# Altium schematic sheet Power.SchDoc
size A4
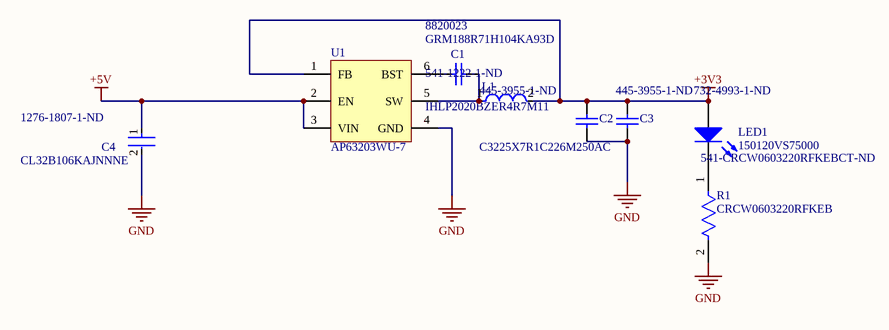
[diagram p0: Power.SchDoc]

## Parts
C1  GRM188R71H104KA93D  Supplier Part Number 1: 8820023  [CAPC1608X90X35ML10T15]
C2  C3225X7R1C226M250AC  Supplier Part Number 1: 445-3955-1-ND  [CAPC3225X280X20LL40]
C3  Supplier Part Number 1: 445-3955-1-ND  [CAPC3225X280X20LL40]  (hidden comment: C3225X7R1C226M250AC)
C4  CL32B106KAJNNNE  Supplier Part Number 1: 1276-1807-1-ND  [FP-CL32-IPC_C]
L1  IHLP2020BZER4R7M11  Supplier Part Number 1: 541-1222-1-ND  [FP-IHLP-2020BZ-FP_1_905x2-MFG]
LED1  150120VS75000  Supplier Part Number 1: 732-4993-1-ND  [1206_A]
R1  CRCW0603220RFKEB  Supplier Part Number 1: 541-CRCW0603220RFKEBCT-ND  [FP-CRCW0603-e3-MFG]
U1  Manufacturer Part Number 1: AP63203WU-7  [TSOT26]  (hidden comment: 3.3V SW Reg (AP63203WU-7))

## Nets
+3V3: C2.2 C3.2 L1.2 LED1.2(A) U1.1(FB)
+5V: C4.1 U1.2(EN) U1.3(VIN)
GND: C2.1 C3.1 C4.2 R1.2 U1.4(GND)
NetC1_1: C1.1 L1.1 U1.5(SW)
NetC1_2: C1.2 U1.6(BST)
NetLED1_1: LED1.1(K) R1.1

## Library data of the parts
C1 = CMP-2100-03643-1: Chip Capacitor, 0.1 uF, +/- 10%, 50 V, -55 to 125 degC, 0603 (1608 Metric), RoHS, Tape and Reel; Manufacturer: Murata; Dielectric Material: Ceramic; Voltage Rating: 50V; Capacitance: 100nF; Dielectric: X7R; Insulation Resistance: 10GR; Description: CERAMIC CAPACITOR, 0.1UF, 50V, X7R, 10%, 0603, FULL REEL; Product Range:GRM Series; Capacitance:0.1 F; Capacitance Tolerance:  10%; Dielectric Characteristic:X7R; Voltage Rating:50V; Ceramic Capacitor Case:0603 ^1608 Metric]; MSL:-; Case Code (Metric): 1608; Lead Free: LeadFree; Depth: 0.8mm; Number of Pins: 2; Radiation Hardening: No; Case/Package: 0603; Manufacturer URL: http://www.murata.com/; Packaging: TapeandReel; Length: 1.6mm; Contact Plating: Tin; Datasheet URL: http://psearch.en.murata.com/capacitor/product/GRM188R71H104KA93%23.pdf; Tolerance: 10%; Case Code (Imperial): 0603; Min Operating Temperature: -55degC; RoHSCompliant: true; Voltage: 50V; Termination: SMD/SMT; Mount: SurfaceMount; Material: Ceramic; Package Quantity: 1; Height: 0.8mm; Thickness: 0.035inch; REACH SVHC: NoSVHC; Max Operating Temperature: 125degC; Width: 0.8mm; Package Reference: 0603; Voltage Rating (DC): 50V; Datasheet Version: 42675.0; Package Description: 2-Pin Surface Mount Device, Body 1.6 x 0.8 mm; Supplier 1: Farnell; Manufacturer Part Number: GRM188R71H104KA93D; RoHS: Yes; Category: Ceramic Capacitors; ComponentLink1URL: https://datasheet.ciiva.com/11786/0900766b807a1cab-11786047.pdf?src-supplier=RSComponents; ComponentLink1Description: https://datasheet.ciiva.com/11786/0900766b807a1cab-11786047.pdf?src-supplier=RSComponents; ComponentLink2URL: https://datasheet.ciiva.com/19467/1857604-19467681.pdf?src-supplier=Jameco; ComponentLink2Description: https://datasheet.ciiva.com/19467/1857604-19467681.pdf?src-supplier=Jameco; ComponentLink3URL: https://datasheet.ciiva.com/29201/451744-da-01-en-vs-kondensator-0603-29201904.pdf?src-supplier=Conrad; ComponentLink3Description: https://datasheet.ciiva.com/29201/451744-da-01-en-vs-kondensator-0603-29201904.pdf?src-supplier=Conrad; ComponentLink4URL: https://datasheet.ciiva.com/28534/4360-28534245.pdf?src-supplier=Element14; ComponentLink4Description: https://datasheet.ciiva.com/28534/4360-28534245.pdf?src-supplier=Element14; ComponentLink5URL: https://datasheet.ciiva.com/131/partnumbering-e-01-131738.pdf?src-supplier=Digi-Key; ComponentLink5Description: https://datasheet.ciiva.com/131/partnumbering-e-01-131738.pdf?src-supplier=Digi-Key; ComponentLink6URL: https://datasheet.ciiva.com/131/partnumbering-e-01-131739.pdf?src-supplier=Digi-Key; ComponentLink6Description: https://datasheet.ciiva.com/131/partnumbering-e-01-131739.pdf?src-supplier=Digi-Key; ComponentLink7URL: https://datasheet.ciiva.com/7937/4360-7937659.pdf?src-supplier=Element14; ComponentLink7Description: https://datasheet.ciiva.com/7937/4360-7937659.pdf?src-supplier=Element14; ComponentLink8URL: https://datasheet.ciiva.com/7937/1747470-7937658.pdf?src-supplier=Element14; ComponentLink8Description: https://datasheet.ciiva.com/7937/1747470-7937658.pdf?src-supplier=Element14; ComponentLink9URL: https://datasheet.ciiva.com/48436/nmgrm-data-en-48436667.pdf?src-supplier=Distrelec; ComponentLink9Description: https://datasheet.ciiva.com/48436/nmgrm-data-en-48436667.pdf?src-supplier=Distrelec; ComponentLink10URL: https://datasheet.ciiva.com/131/partnumbering-e-01-131740.pdf?src-supplier=Digi-Key; ComponentLink10Description: https://datasheet.ciiva.com/131/partnumbering-e-01-131740.pdf?src-supplier=Digi-Key; ComponentLink11URL: https://datasheet.ciiva.com/14116/nmgrm-data-en-14116602.pdf?src-supplier=Distrelec; ComponentLink11Description: https://datasheet.ciiva.com/14116/nmgrm-data-en-14116602.pdf?src-supplier=Distrelec
C2 C3 = CMP-2000-06052-1: Multilayer Ceramic Capacitor, 22 uF, 16 V, -55 to 125 degC, 2-Pin SMD, RoHS, Tape and Reel; PCN Part Number: MLCCPartNumberChange30/Nov/2012; Manufacturer: TDK; Tolerance: ±20%; Online Catalog: CSeries,GeneralPurpose; Catalog Drawings: CSERIES_1210_2.8; Capacitance: 22µF; Voltage - Rated: 16V; Temperature Coefficient: X7R; Other Names: 445-3955-6; Product Training Modules: HighCapacitanceReplacementCSeriesGeneralApplicationsSEAT,CCV,andTVCLDesignToolsGuidetoReplacinganElectrolyticCapacitorwithanMLCC; Description: TDK - C3225X7R1C226M250AC - SMD Multilayer Ceramic Capacitor, 22 &#181;F, 16 V, 1210 [3225 Metric], &#177; 20%, X7R, C Series; Lead Style: -; Thickness (Max): 0.110"(2.80mm); Lead Spacing: -; Package Reference: 1210; Package / Case: 1210(3225Metric); Operating Temperature: -55°C~125°C; Standard Package: 1; Features: -; Datasheet URL: https://datasheet.ciiva.com/24216/c3225x7r1c226m250ac-265468-24216381.pdf; Manufacturer URL: http://www.tdk.com/; Datasheet Version: 09/2013; Mounting Technology: SurfaceMount; Family: CeramicCapacitors; Height - Seated (Max): -; Mounting Type: SurfaceMount,MLCC; Series: C; Size / Dimension: 0.126"Lx0.098"W(3.20mmx2.50mm); Packaging: Digi-Reel®; Ratings: -; Package Description: 2-Pin Surface Mount Device, Body 3.2 x 2.5 mm; Applications: GeneralPurpose; RoHS Information: RoHSCertificate-MLCC; Category: Capacitors; Supplier 1: Digi-Key; Manufacturer Part Number: C3225X7R1C226M250AC; RoHS: Yes; Stock 1: 684134; Mount: Surface Mount; Case/Package: 1210; Number of Pins: 2; Weight: 0.000564oz; Case Code (Metric): 3225; Case Code (Imperial): 1210; Dielectric Material: Ceramic; Min Operating Temperature: -55°C; Max Operating Temperature: 125°C; Dielectric: X7R; Package Quantity: 1; Voltage Rating: 16V; Voltage Rating (DC): 16V; Termination: SMD/SMT; Resistor Type: Ceramic; Length: 3.2mm; Height: 2.5mm; Depth: 2.5mm; Width: 0.098inch; Thickness: 0.11inch; Radiation Hardening: No; REACH SVHC: No SVHC; Lead Free: Lead Free; ComponentLink1URL: https://datasheet.ciiva.com/24216/c3225x7r1c226m250ac-265468-24216381.pdf?src-supplier=Mouser; ComponentLink1Description: https://datasheet.ciiva.com/24216/c3225x7r1c226m250ac-265468-24216381.pdf?src-supplier=Mouser; ComponentLink2URL: https://datasheet.ciiva.com/6252/tdkmlcccaprange-6252933.pdf?src-supplier=Digi-Key; ComponentLink2Description: https://datasheet.ciiva.com/6252/tdkmlcccaprange-6252933.pdf?src-supplier=Digi-Key; ComponentLink3URL: https://datasheet.ciiva.com/7975/639999-7975159.pdf?src-supplier=Element14; ComponentLink3Description: https://datasheet.ciiva.com/7975/639999-7975159.pdf?src-supplier=Element14; ComponentLink4URL: https://datasheet.ciiva.com/6145/1571323-6145128.pdf?src-supplier=Farnell; ComponentLink4Description: https://datasheet.ciiva.com/6145/1571323-6145128.pdf?src-supplier=Farnell; ComponentLink5URL: https://datasheet.ciiva.com/28620/1571323-28620648.pdf?src-supplier=Element14; ComponentLink5Description: https://datasheet.ciiva.com/28620/1571323-28620648.pdf?src-supplier=Element14; ComponentLink6URL: https://datasheet.ciiva.com/6252/tdkmlcccaprange-6252937.pdf?src-supplier=Digi-Key; ComponentLink6Description: https://datasheet.ciiva.com/6252/tdkmlcccaprange-6252937.pdf?src-supplier=Digi-Key; ComponentLink7URL: https://datasheet.ciiva.com/17487/e412-c-17487337.pdf?src-supplier=Avnet+Europe; ComponentLink7Description: https://datasheet.ciiva.com/17487/e412-c-17487337.pdf?src-supplier=Avnet+Europe; ComponentLink8URL: https://datasheet.ciiva.com/15192/getdatasheetpartid-715071-15192314.pdf?src-supplier=Verical; ComponentLink8Description: https://datasheet.ciiva.com/15192/getdatasheetpartid-715071-15192314.pdf?src-supplier=Verical; ComponentLink9URL: https://datasheet.ciiva.com/6252/tdkmlcccaprange-6252940.pdf?src-supplier=Digi-Key; ComponentLink9Description: https://datasheet.ciiva.com/6252/tdkmlcccaprange-6252940.pdf?src-supplier=Digi-Key; ComponentLink10URL: https://datasheet.ciiva.com/7878/1571323-7878125.pdf?src-supplier=Element14; ComponentLink10Description: https://datasheet.ciiva.com/7878/1571323-7878125.pdf?src-supplier=Element14; ComponentLink11URL: https://datasheet.ciiva.com/16199/e412-c-16199357.pdf?src-supplier=Future+Electronics; ComponentLink11Description: https://datasheet.ciiva.com/16199/e412-c-16199357.pdf?src-supplier=Future+Electronics
C4 = CMP-13271-001383-1: Cap Ceramic 10uF 25V X7R ±10% SMD 1210 +125°C Embossed T/R; Manufacturer: Samsung; Description: Cap Ceramic 10uF 25V X7R 10% SMD 1210 125C Embossed T/R; Capacitance: 10uF; Width: 0.098inch; Min Operating Temperature: -55°C; Case Code (Metric): 3225; Case Code (Imperial): 1210; Material: Ceramic; Height: 2.5mm; Depth: 2.5mm; Contact Plating: Tin; Max Operating Temperature: 125°C; Length: 3.2mm; Mount: Surface Mount; Packaging: Tape and Reel; Dielectric: X7R; Tolerance: 10%; Radiation Hardening: No; Thickness: 0.106inch; Package Quantity: 1000; Voltage Rating: 25V; Voltage: 25V; Case/Package: 1210; Supplier 1: Digi-Key; Manufacturer Part Number: CL32B106KAJNNNE; RoHS: Yes; Category: Ceramic Capacitors; Stock 1: 108118; ComponentLink1URL: https://datasheet.ciiva.com/25791/cl32b106kajnnne-25791845.pdf?src-supplier=Digi-Key; ComponentLink1Description: https://datasheet.ciiva.com/25791/cl32b106kajnnne-25791845.pdf?src-supplier=Digi-Key; ComponentLink2URL: https://datasheet.ciiva.com/16437/cl32b106kajnnne-16437180.pdf?src-supplier=Future+Electronics; ComponentLink2Description: https://datasheet.ciiva.com/16437/cl32b106kajnnne-16437180.pdf?src-supplier=Future+Electronics; ComponentLink3URL: https://datasheet.ciiva.com/29202/450857-da-01-en-vs-kondensator-1210-29202679.pdf?src-supplier=Conrad; ComponentLink3Description: https://datasheet.ciiva.com/29202/450857-da-01-en-vs-kondensator-1210-29202679.pdf?src-supplier=Conrad
L1 = CMP-02424-000416-1: Fixed Inductors Commercial Low DCR Series 4.7uH 3.2A 81.3mΩ 20%; Manufacturer: Vishay Dale; Saturation Current: 3A; Shielding: Shielded; Core Material: Metal; Self Resonant Frequency: 27MHz; Test Frequency: 100kHz; DC Resistance (DCR): 81.3mR; Description: FIXED IND 4.7UH 3.2A 81.3 MOHM; Height - Seated (Max): 0.079inch; Mount: Surface Mount; Max Operating Temperature: 125°C; Termination: SMD/SMT; Depth: 5.43mm; Lead Free: Lead Free; Inductance Tolerance: 20%; Height: 2mm; Length: 5.49mm; Package Quantity: 2000; Tolerance: 20%; Min Operating Temperature: -55°C; Case/Package: 2020; Radiation Hardening: No; Number of Pins: 2020; Military Standard: Not; Inductance: 4.7uH; Packaging: Tape and Reel; Width: 0.204inch; Current Rating: 3.2A; RMS Current (Irms): 3.2A; Max DC Current: 3A; Supplier 1: Digi-Key; Manufacturer Part Number: IHLP2020BZER4R7M11; RoHS: Yes; Category: Fixed Inductors; Stock 1: 301; REACH SVHC: Unknown; ComponentLink1URL: https://datasheet.ciiva.com/11798/0900766b8102c92e-11798345.pdf?src-supplier=RSComponents; ComponentLink1Description: https://datasheet.ciiva.com/11798/0900766b8102c92e-11798345.pdf?src-supplier=RSComponents; ComponentLink2URL: https://datasheet.ciiva.com/16496/lp20bz11-16496630.pdf?src-supplier=Future+Electronics; ComponentLink2Description: https://datasheet.ciiva.com/16496/lp20bz11-16496630.pdf?src-supplier=Future+Electronics; ComponentLink3URL: https://datasheet.ciiva.com/1051/lp20bz11-1051771.pdf?src-supplier=Digi-Key; ComponentLink3Description: https://datasheet.ciiva.com/1051/lp20bz11-1051771.pdf?src-supplier=Digi-Key; ComponentLink4URL: https://datasheet.ciiva.com/1051/lp20bz11-1051772.pdf?src-supplier=Digi-Key; ComponentLink4Description: https://datasheet.ciiva.com/1051/lp20bz11-1051772.pdf?src-supplier=Digi-Key; ComponentLink5URL: https://datasheet.ciiva.com/1051/lp20bz11-1051773.pdf?src-supplier=Digi-Key; ComponentLink5Description: https://datasheet.ciiva.com/1051/lp20bz11-1051773.pdf?src-supplier=Digi-Key
LED1 = CMP-1426-00016-1: SMD mono-color Chip LED, WL-SMCW, Bright Green; Manufacturer: Wuerth Elektronik; Description: LED, Green, 570 nm, 2 V, 30 mA, 40 mcd; Luminous Intensity: 40mcd; Forward Current: 30mA; Forward Voltage: 2V; Viewing Angle: 140°; Lens Style: Clear,Rectangular; Wavelength: 570nm; Test Current: 20mA; ComponentLink2URL: http://katalog.we-online.com/led/datasheet/150120VS75000.pdf; PartNumber: 150120VS75000; Color: Bright Green; ComponentLink2Description: Datasheet; ComponentLink1URL: http://www.we-online.com; PackageReference: 1206_A; ComponentLink1Description: Manufacturer URL; Supplier 1: Digi-Key; Manufacturer Part Number: 150120VS75000; RoHS: Yes; Category: LEDs; Stock 1: 4286; Mount: Surface Mount; Case/Package: 1206; Case Code (Metric): 3216; Case Code (Imperial): 1206; Min Operating Temperature: -40°C; Max Operating Temperature: 85°C; Package Quantity: 1; Packaging: Tape and Reel; Dominant Wavelength: 570nm; Length: 3.2mm; Height: 0.68mm; Width: 1.6mm; REACH SVHC: Unknown; ComponentLink3URL: https://datasheet.ciiva.com/29561/150120vs75000-29561865.pdf?src-supplier=Digi-Key; ComponentLink3Description: https://datasheet.ciiva.com/29561/150120vs75000-29561865.pdf?src-supplier=Digi-Key; ComponentLink4URL: https://datasheet.ciiva.com/29279/759444-da-01-en-chipled-1206-w-kl-h-gruen-150120vs7500-29279050.pdf?src-supplier=Conrad; ComponentLink4Description: https://datasheet.ciiva.com/29279/759444-da-01-en-chipled-1206-w-kl-h-gruen-150120vs7500-29279050.pdf?src-supplier=Conrad; ComponentLink5URL: https://datasheet.ciiva.com/29561/150120vs75000-29561866.pdf?src-supplier=Digi-Key; ComponentLink5Description: https://datasheet.ciiva.com/29561/150120vs75000-29561866.pdf?src-supplier=Digi-Key; ComponentLink6URL: https://datasheet.ciiva.com/22656/1911467-22656987.pdf?src-supplier=Element14; ComponentLink6Description: https://datasheet.ciiva.com/22656/1911467-22656987.pdf?src-supplier=Element14; ComponentLink7URL: https://datasheet.ciiva.com/29561/150120vs75000-29561867.pdf?src-supplier=Digi-Key; ComponentLink7Description: https://datasheet.ciiva.com/29561/150120vs75000-29561867.pdf?src-supplier=Digi-Key
R1 = CMP-02407-003555-1: RES Thick Film, 220Ω, 1%, 0.1W, 100ppm/°C, 0603; Manufacturer: Vishay Dale; Voltage Rating: 75V; Power Rating: 100mW; Resistance: 220R; Description: RES SMD 220 OHM 1% 1/10W 0603; Length: 1.55mm; Weight: 7.1E-05oz; Package Quantity: 10000; Case/Package: 0603; Composition: Thick Film; Max Operating Temperature: 155°C; Military Standard: Not; Tolerance: 1%; Lead Free: Lead Free; Number of Terminations: 2; Min Operating Temperature: -55°C; Case Code (Imperial): 0603; Max Power Dissipation: 100mW; Features: Automotive AEC-Q200; Packaging: Tape and Reel; Temperature Coefficient: 100ppm/°C; Case Code (Metric): 1608; Termination: SMD/SMT; Depth: 0.85mm; Height: 0.02inch; Width: 0.85mm; Supplier 1: Digi-Key; Manufacturer Part Number: CRCW0603220RFKEB; RoHS: Yes; Category: Chip SMD Resistors; Stock 1: 12344; Resistor Type: Thick Film; ComponentLink1URL: https://datasheet.ciiva.com/16430/dcrcwe3-16430094.pdf?src-supplier=Future+Electronics; ComponentLink1Description: https://datasheet.ciiva.com/16430/dcrcwe3-16430094.pdf?src-supplier=Future+Electronics
U1 = 3.3V SW Reg (AP63203WU-7): AP63203 Series 3.3 V 2 A SMT Fixed Low IQ Synchronous Buck - TSOT-26; Manufacturer 1: Diodes; Supplier 1: Digi-Key; Supplier Part Number 1: AP63203WU-7DICT-ND; Stock 1: 9889; Pricing 1: 1=0.83000, 10=0.74500, 25=0.70720, 100=0.54290, 250=0.47976, 500=0.45450, 1000=0.35350 (USD); RoHS: No; ComponentLink1Description: https://datasheet.octopart.com/AP63203WU-7-Diodes-Inc.-datasheet-130008827.pdf; ComponentLink1URL: https://datasheet.octopart.com/AP63203WU-7-Diodes-Inc.-datasheet-130008827.pdf; ComponentLink2Description: https://sigma.octopart.com/138799930/technical_drawing/Diodes-Inc.-AP63203WU-7.pdf; ComponentLink2URL: https://sigma.octopart.com/138799930/technical_drawing/Diodes-Inc.-AP63203WU-7.pdf; Manufacturer: Diodes; Manufacturer Part Number: AP63203WU-7